# EAGLE design 控制電路 (EAGLE 7.4.0)
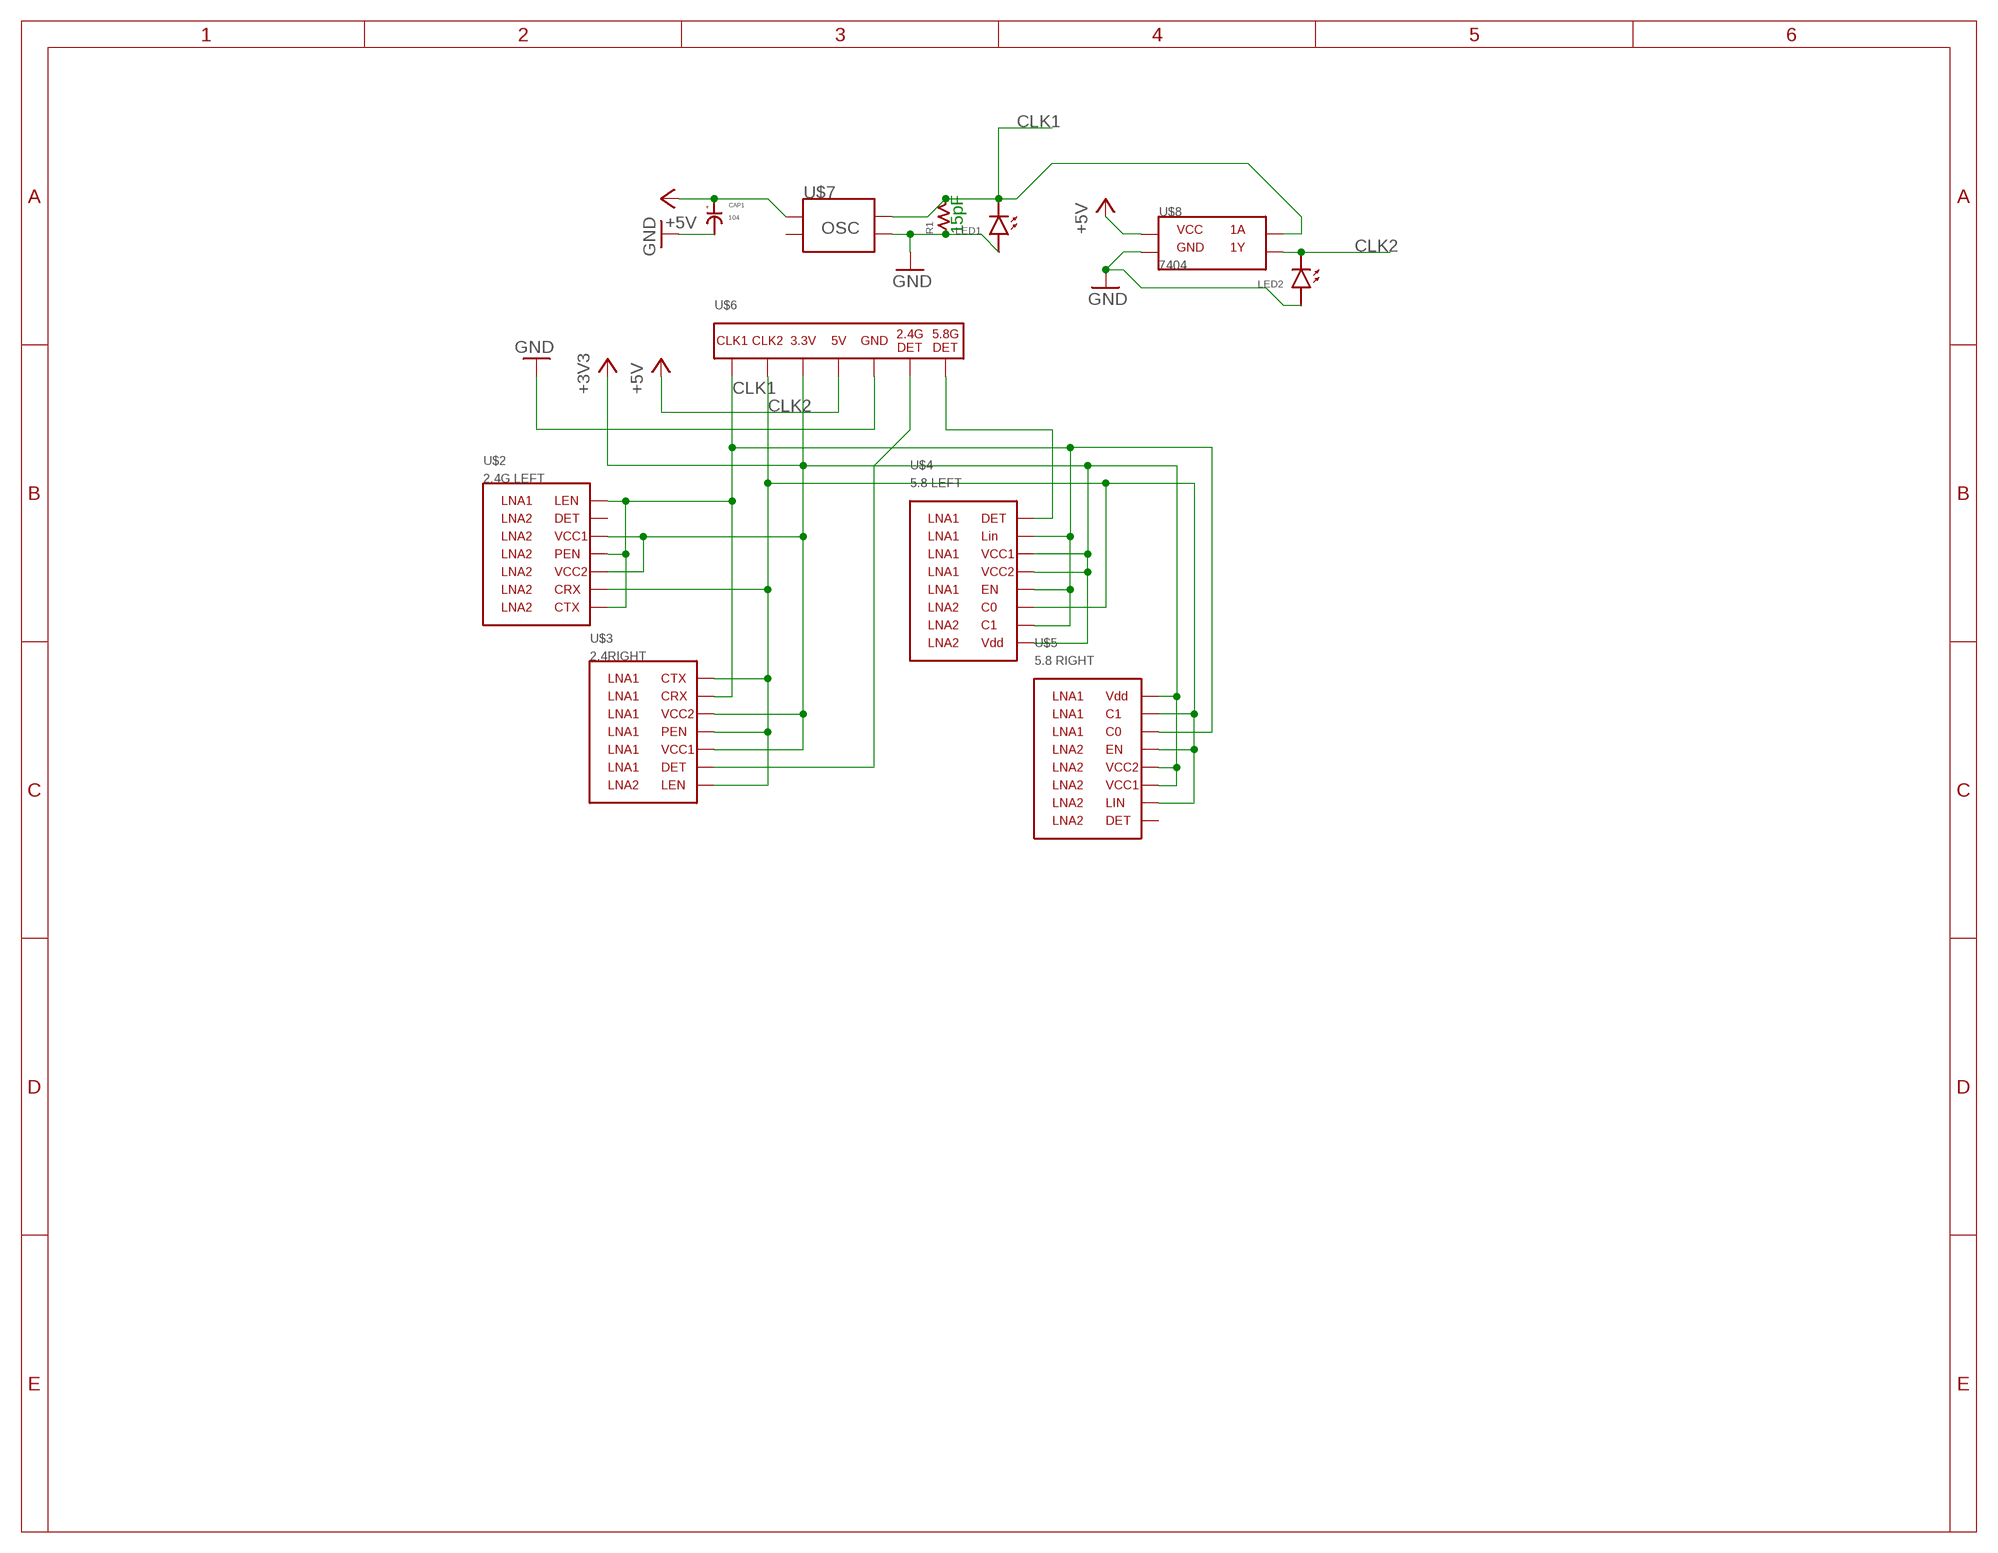
[diagram p0: schematic, sheet 1]

## Parts
CAP1  104  CAP-100MIL  [CAP-100MIL]
LED1  LED-5MM  [2-PIN-200MIL-LED]
LED2  LED-5MM  [2-PIN-200MIL-LED]
R1  RESISTOR-200MIL  [RESISTOR-200MIL]
U$2  PROJECT-2.4G-LEFTSIDE  [PROJECT-2.4G-LEFTSIDE]
U$3  PROJECT-2.4G-RIGHTSIDE  [PROJECT-2.4G-RIGHTSIDE]
U$4  PROJECT-5G-LEFTSIDE  [PROJECT-5G-LEFTSIDE]
U$5  PROJECT-5G-RIGHTSIDE  [PROJECT-5G-RIGHTSIDE]
U$6  PROJECT-IO  [PROJECT-IO]
U$7  PROJECT-CRYSTAL  [PROJECT-CRYSTAL]
U$8  PROJECT-7404  [PROJECT-7404]

## Nets
+3V3: U$2.VCC1 U$2.VCC2 U$3.VCC1 U$3.VCC2 U$4.VCC1 U$4.VCC2 U$4.VDD U$5.VCC1 U$5.VCC2 U$5.VDD U$6.3.3V
+5V: CAP1.P$1 U$6.5V U$7.P$1 U$8.P$14
CLK1: LED1.L-(LED-) R1.P$2 U$2.CTX U$2.LEN U$2.PEN U$3.CRX U$4.C1 U$4.EN U$4.LIN U$5.C0 U$6.CLK1 U$7.P$4 U$8.P$1
CLK2: LED2.L-(LED-) U$2.CRX U$3.CTX U$3.LEN U$3.PEN U$4.C0 U$5.C1 U$5.EN U$5.LIN U$6.CLK2 U$8.P$2
GND: CAP1.P$2 LED1.L+(LED+) LED2.L+(LED+) R1.P$1 U$6.GND U$7.P$3 U$8.P$7
N$3: U$3.DET U$6.2.4DET
N$6: U$4.DET U$6.5.8DET
Unconnected: U$2.DET U$5.DET U$7.P$2

## Notes on the sheet
- 15pF

## Library data of the parts
CAP1 = ncue_ee:CAP-100MIL
LED1 LED2 = ncue_ee:LED-5MM
R1 = ncue_ee:RESISTOR-200MIL
U$2 = ncue_ee:PROJECT-2.4G-LEFTSIDE
U$3 = ncue_ee:PROJECT-2.4G-RIGHTSIDE
U$4 = ncue_ee:PROJECT-5G-LEFTSIDE
U$5 = ncue_ee:PROJECT-5G-RIGHTSIDE
U$6 = ncue_ee:PROJECT-IO
U$7 = ncue_ee:PROJECT-CRYSTAL
U$8 = ncue_ee:PROJECT-7404

## Board
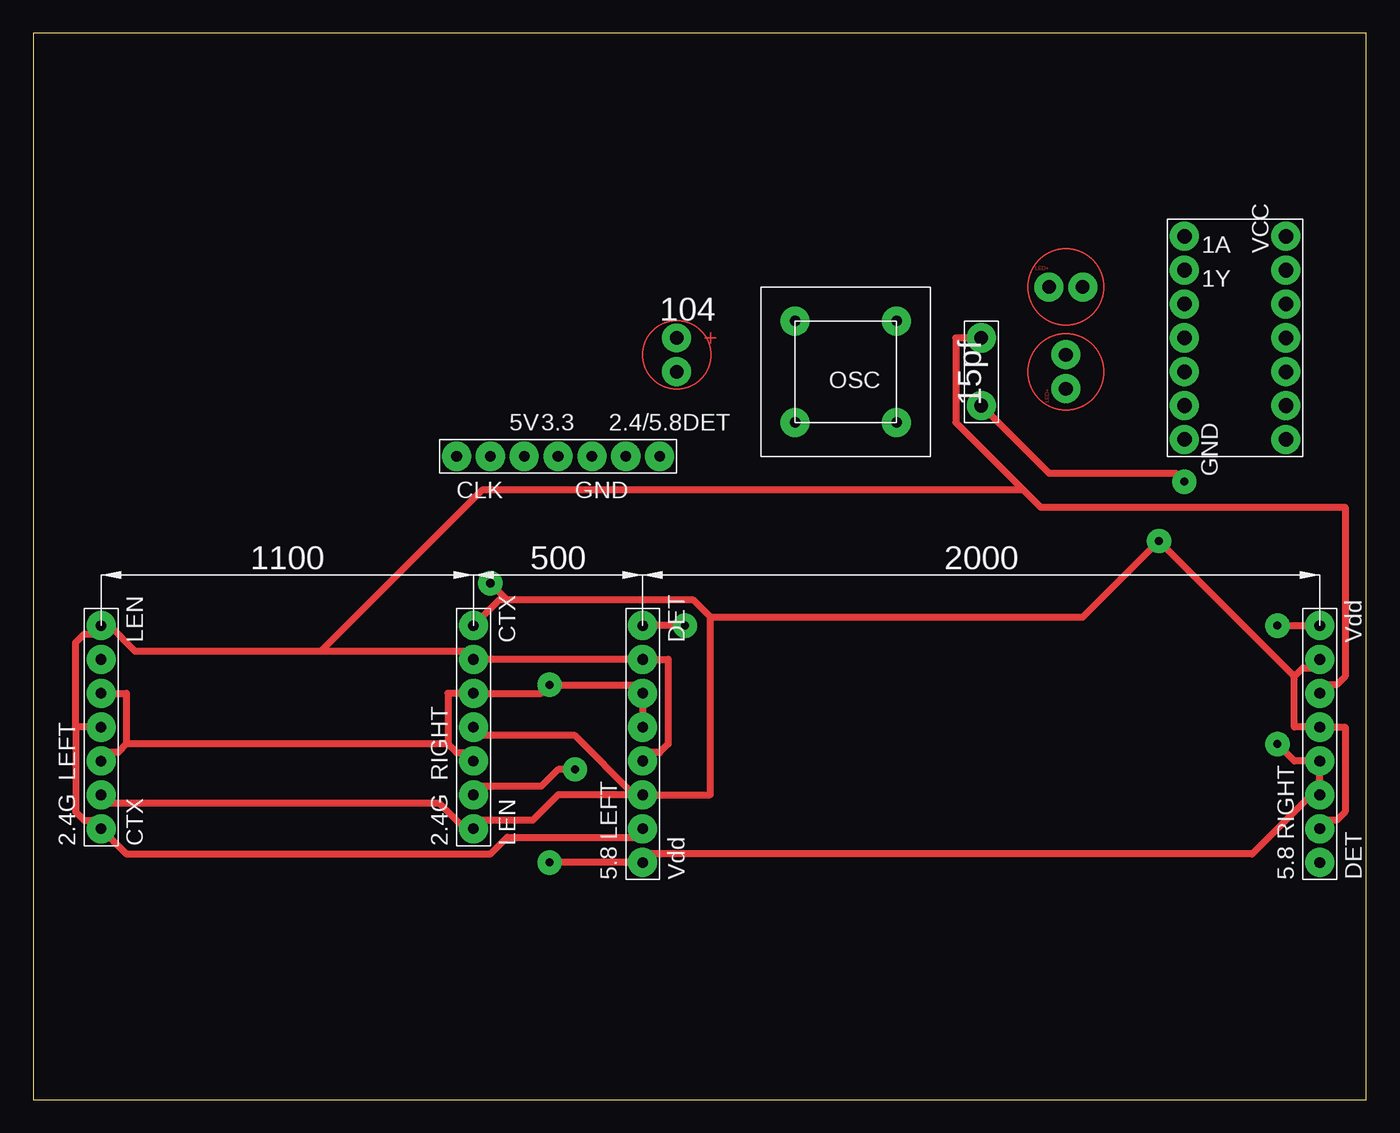
[diagram p1: board, top side]
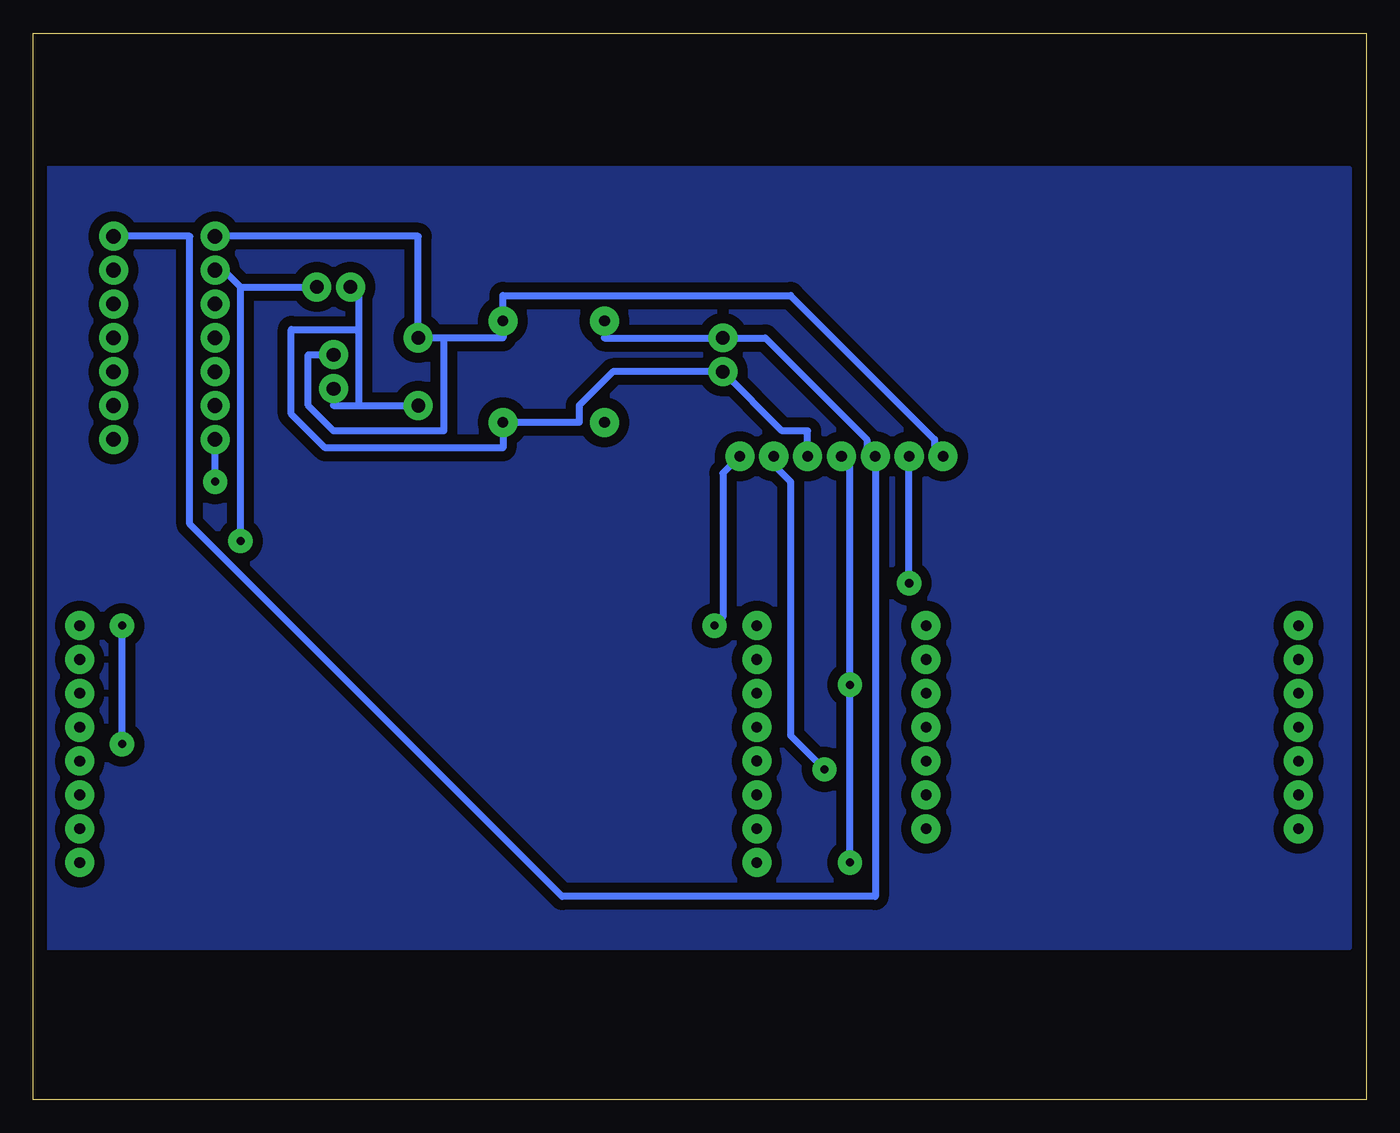
[diagram p2: board, bottom side, seen from below]

Size 100 x 80 mm. Coordinates in mm from the lower left corner, seen from the top.
Outline: 0,0 100,0 100,80 0,80 0,0
Copper layers (1*16): Top 0.035mm / dielectric 1.5mm / Bottom 0.035mm
Design rules "default *": minimum track width 20mil, minimum drill 24mil, track to track 30mil, track to pad 30mil, pad to pad 30mil, via to via 30mil, smd to smd 8mil, copper to edge 40mil, drill to drill 8mil, minimum pad ring 10mil, minimum via ring 16mil, stop-mask expansion 4mil, vias tented up to drill 0mil, thermal gap 10mil

### Footprints (pad centres in the part's own frame; a part is rotated, then mirrored left to right if it is on the bottom)
CAP-100MIL = drill 1.016 pad 2.159: P$1 0,0; P$2 2.54,0
2-PIN-200MIL-LED = drill 1.016 pad 2.184: L+ -1.27,0; L- 1.27,0
RESISTOR-200MIL = drill 1.016 pad 2.184: P$1 0,0; P$2 5.08,0
PROJECT-2.4G-LEFTSIDE = drill 0.8 pad 2.184: CRX 1.27,-13.97; CTX 1.27,-16.51; DET 1.27,-3.81; LEN 1.27,-1.27; PEN 1.27,-8.89; VCC1 1.27,-6.35; VCC2 1.27,-11.43
PROJECT-2.4G-RIGHTSIDE = drill 0.8 pad 2.184: CRX 1.27,-3.81; CTX 1.27,-1.27; DET 1.27,-13.97; LEN 1.27,-16.51; PEN 1.27,-8.89; VCC1 1.27,-11.43; VCC2 1.27,-6.35
PROJECT-5G-LEFTSIDE = drill 0.8 pad 2.184: C0 0,-12.7; C1 0,-15.24; DET 0,0; EN 0,-10.16; LIN 0,-2.54; VCC1 0,-5.08; VCC2 0,-7.62; VDD 0,-17.78
PROJECT-5G-RIGHTSIDE = drill 0.8 pad 2.184: C0 1.27,-6.35; C1 1.27,-3.81; DET 1.27,-19.05; EN 1.27,-8.89; LIN 1.27,-16.51; VCC1 1.27,-13.97; VCC2 1.27,-11.43; VDD 1.27,-1.27
PROJECT-IO = drill 0.8 pad 2.184: 2.4DET 12.7,0; 3.3V 7.62,0; 5.8DET 15.24,0; 5V 5.08,0; CLK1 0,0; CLK2 2.54,0; GND 10.16,0
PROJECT-CRYSTAL = drill 0.8 pad 2.184: P$1 0,0; P$2 0,-7.62; P$3 7.62,-7.62; P$4 7.62,0
PROJECT-7404 = drill 1.092 pad 2.184: P$1 0,0; P$2 0,-2.54; P$3 0,-5.08; P$4 0,-7.62; P$5 0,-10.16; P$6 0,-12.7; P$7 0,-15.24; P$8 7.62,-15.24; P$9 7.62,-12.7; P$10 7.62,-10.16; P$11 7.62,-7.62; P$12 7.62,-5.08; P$13 7.62,-2.54; P$14 7.62,0

### Placement (x,y rotation side)
CAP1  [CAP-100MIL]  48.26,57.15 270 top
LED1  77.47,54.61 90 top
LED2  77.47,60.96 0 top
R1  71.12,52.07 90 top
U$2  3.81,36.83 0 top
U$3  31.75,36.83 0 top
U$4  45.72,35.56 0 top
U$5  95.25,36.83 0 top
U$6  31.75,48.26 0 top
U$7  57.15,58.42 0 top
U$8  86.36,64.77 0 top

### Tracks (layer width: path | path; a pad name or v marks a point on that pad's centre or on a via)
+3V3  (via drill 0.61)
  Top 0.508: U$2.VCC2 5.71,26.04 6.35,26.04 6.99,26.67 | 6.99,26.67 6.99,30.48 U$2.VCC1 | U$4.VCC2 U$4.VCC1 45.09,31.11 v38.73,31.11 38.1,30.48 U$3.VCC2 31.11,30.48 31.11,26.67 | U$3.VCC1 32.38,26.04 31.75,26.04 31.11,26.67 | 31.11,26.67 6.99,26.67 | v93.34,35.56 U$5.VDD | v93.34,26.67 94.61,25.4 U$5.VCC2 U$5.VCC1 95.89,22.86 91.44,18.41 46.35,18.41 U$4.VDD v38.73,17.78
  Bottom 0.508: U$6.3.3V 38.73,47.62 v38.73,31.11 v38.73,17.78 | v93.34,26.67 v93.34,35.56
+5V
  Bottom 0.508: U$7.P$1 57.15,57.15 CAP1.P$1 45.09,57.15 37.47,49.53 37.47,48.9 U$6.5V 36.83,15.24 60.33,15.24 88.27,43.18 88.27,64.77 U$8.P$14
CLK1
  Top 0.508: U$4.EN 46.35,26.04 46.99,26.04 47.62,26.67 47.62,33.02 U$4.LIN U$3.CRX 32.38,33.66 21.59,33.66 | 3.17,27.94 3.17,21.59 3.81,20.95 4.45,20.95 U$2.CTX 6.99,18.41 34.29,18.41 35.56,19.68 45.09,19.68 U$4.C1 | U$2.PEN 3.17,27.94 | 3.17,27.94 3.17,34.29 3.81,34.92 4.45,34.92 U$2.LEN 5.71,35.56 7.62,33.66 21.59,33.66 | U$5.C0 97.16,31.11 97.79,31.11 98.42,31.75 98.42,44.45 75.56,44.45 74.3,45.72 | 74.3,45.72 69.22,50.8 69.22,57.15 R1.P$2 | 21.59,33.66 33.66,45.72 74.3,45.72
  Bottom 0.508: U$6.CLK1 32.38,48.9 32.38,49.53 43.18,60.33 64.77,60.33 U$7.P$4 64.77,57.15 69.22,57.15 | 69.22,57.15 R1.P$2 71.12,64.77 U$8.P$1 | LED1.L- 79.38,55.88 79.38,52.07 77.47,50.16 69.22,50.16 69.22,57.15
CLK2  (via drill 0.61)
  Top 0.508: U$5.LIN 97.16,20.95 97.79,20.95 98.42,21.59 98.42,27.94 U$5.EN 94.61,27.94 94.61,31.75 | U$5.C1 95.89,32.38 95.25,32.38 94.61,31.75 | 94.61,31.75 v84.45,41.91 78.74,36.2 50.8,36.2 | 45.09,22.86 39.37,22.86 37.47,20.95 33.66,20.95 U$3.LEN 32.38,20.32 30.48,22.23 5.71,22.23 U$2.CRX | U$3.PEN 33.66,27.3 40.64,27.3 45.09,22.86 | 45.09,22.86 U$4.C0 50.8,22.86 50.8,36.2 | U$3.CTX 34.92,37.47 35.56,37.47 | 35.56,37.47 49.53,37.47 50.8,36.2 | 35.56,37.47 v34.29,38.73
  Bottom 0.508: 84.45,60.96 LED2.L- | 84.45,60.96 85.72,62.23 U$8.P$2 | v84.45,41.91 84.45,60.96 | v34.29,38.73 U$6.CLK2
GND  (via drill 0.61)
  Top 0.508: v86.36,46.35 85.72,46.99 76.2,46.99 R1.P$1
  Bottom 0.508: 75.56,52.07 77.47,52.07 LED1.L+ | 75.56,52.07 R1.P$1 | v86.36,46.35 U$8.P$7 | LED2.L+ 75.56,60.33 75.56,57.78 | 75.56,52.07 75.56,57.78 | U$6.GND 41.91,50.16 43.81,50.16 CAP1.P$2 56.52,54.61 59.05,52.07 59.05,50.8 U$7.P$3 64.77,48.9 78.11,48.9 80.64,51.44 80.64,57.78 75.56,57.78
N$1
  pour Bottom: 1.27,69.85 99.06,69.85 99.06,11.43 1.27,11.43
N$3  (via drill 0.61)
  Top 0.508: U$3.DET 33.66,23.5 38.1,23.5 39.37,24.77 v40.64,24.77
  Bottom 0.508: v40.64,24.77 43.18,27.3 43.18,46.35 44.45,47.62 U$6.2.4DET
N$6  (via drill 0.61)
  Top 0.508: v48.9,35.56 U$4.DET
  Bottom 0.508: v48.9,35.56 48.26,36.2 48.26,46.99 U$6.5.8DET

### Text on the board
tPlace: 104 | 15pf